# EasyEDA Pro project 电机驱动板.epro

# Schematic Schematic1
Create Date: 2023-03-19; Page Name: P1; Project Name: 电机驱动板; Schematic Name: Schematic1; Update Date: 2023-04-09; Company: 嘉立创EDA; Page Size: A4; Version: V1.0
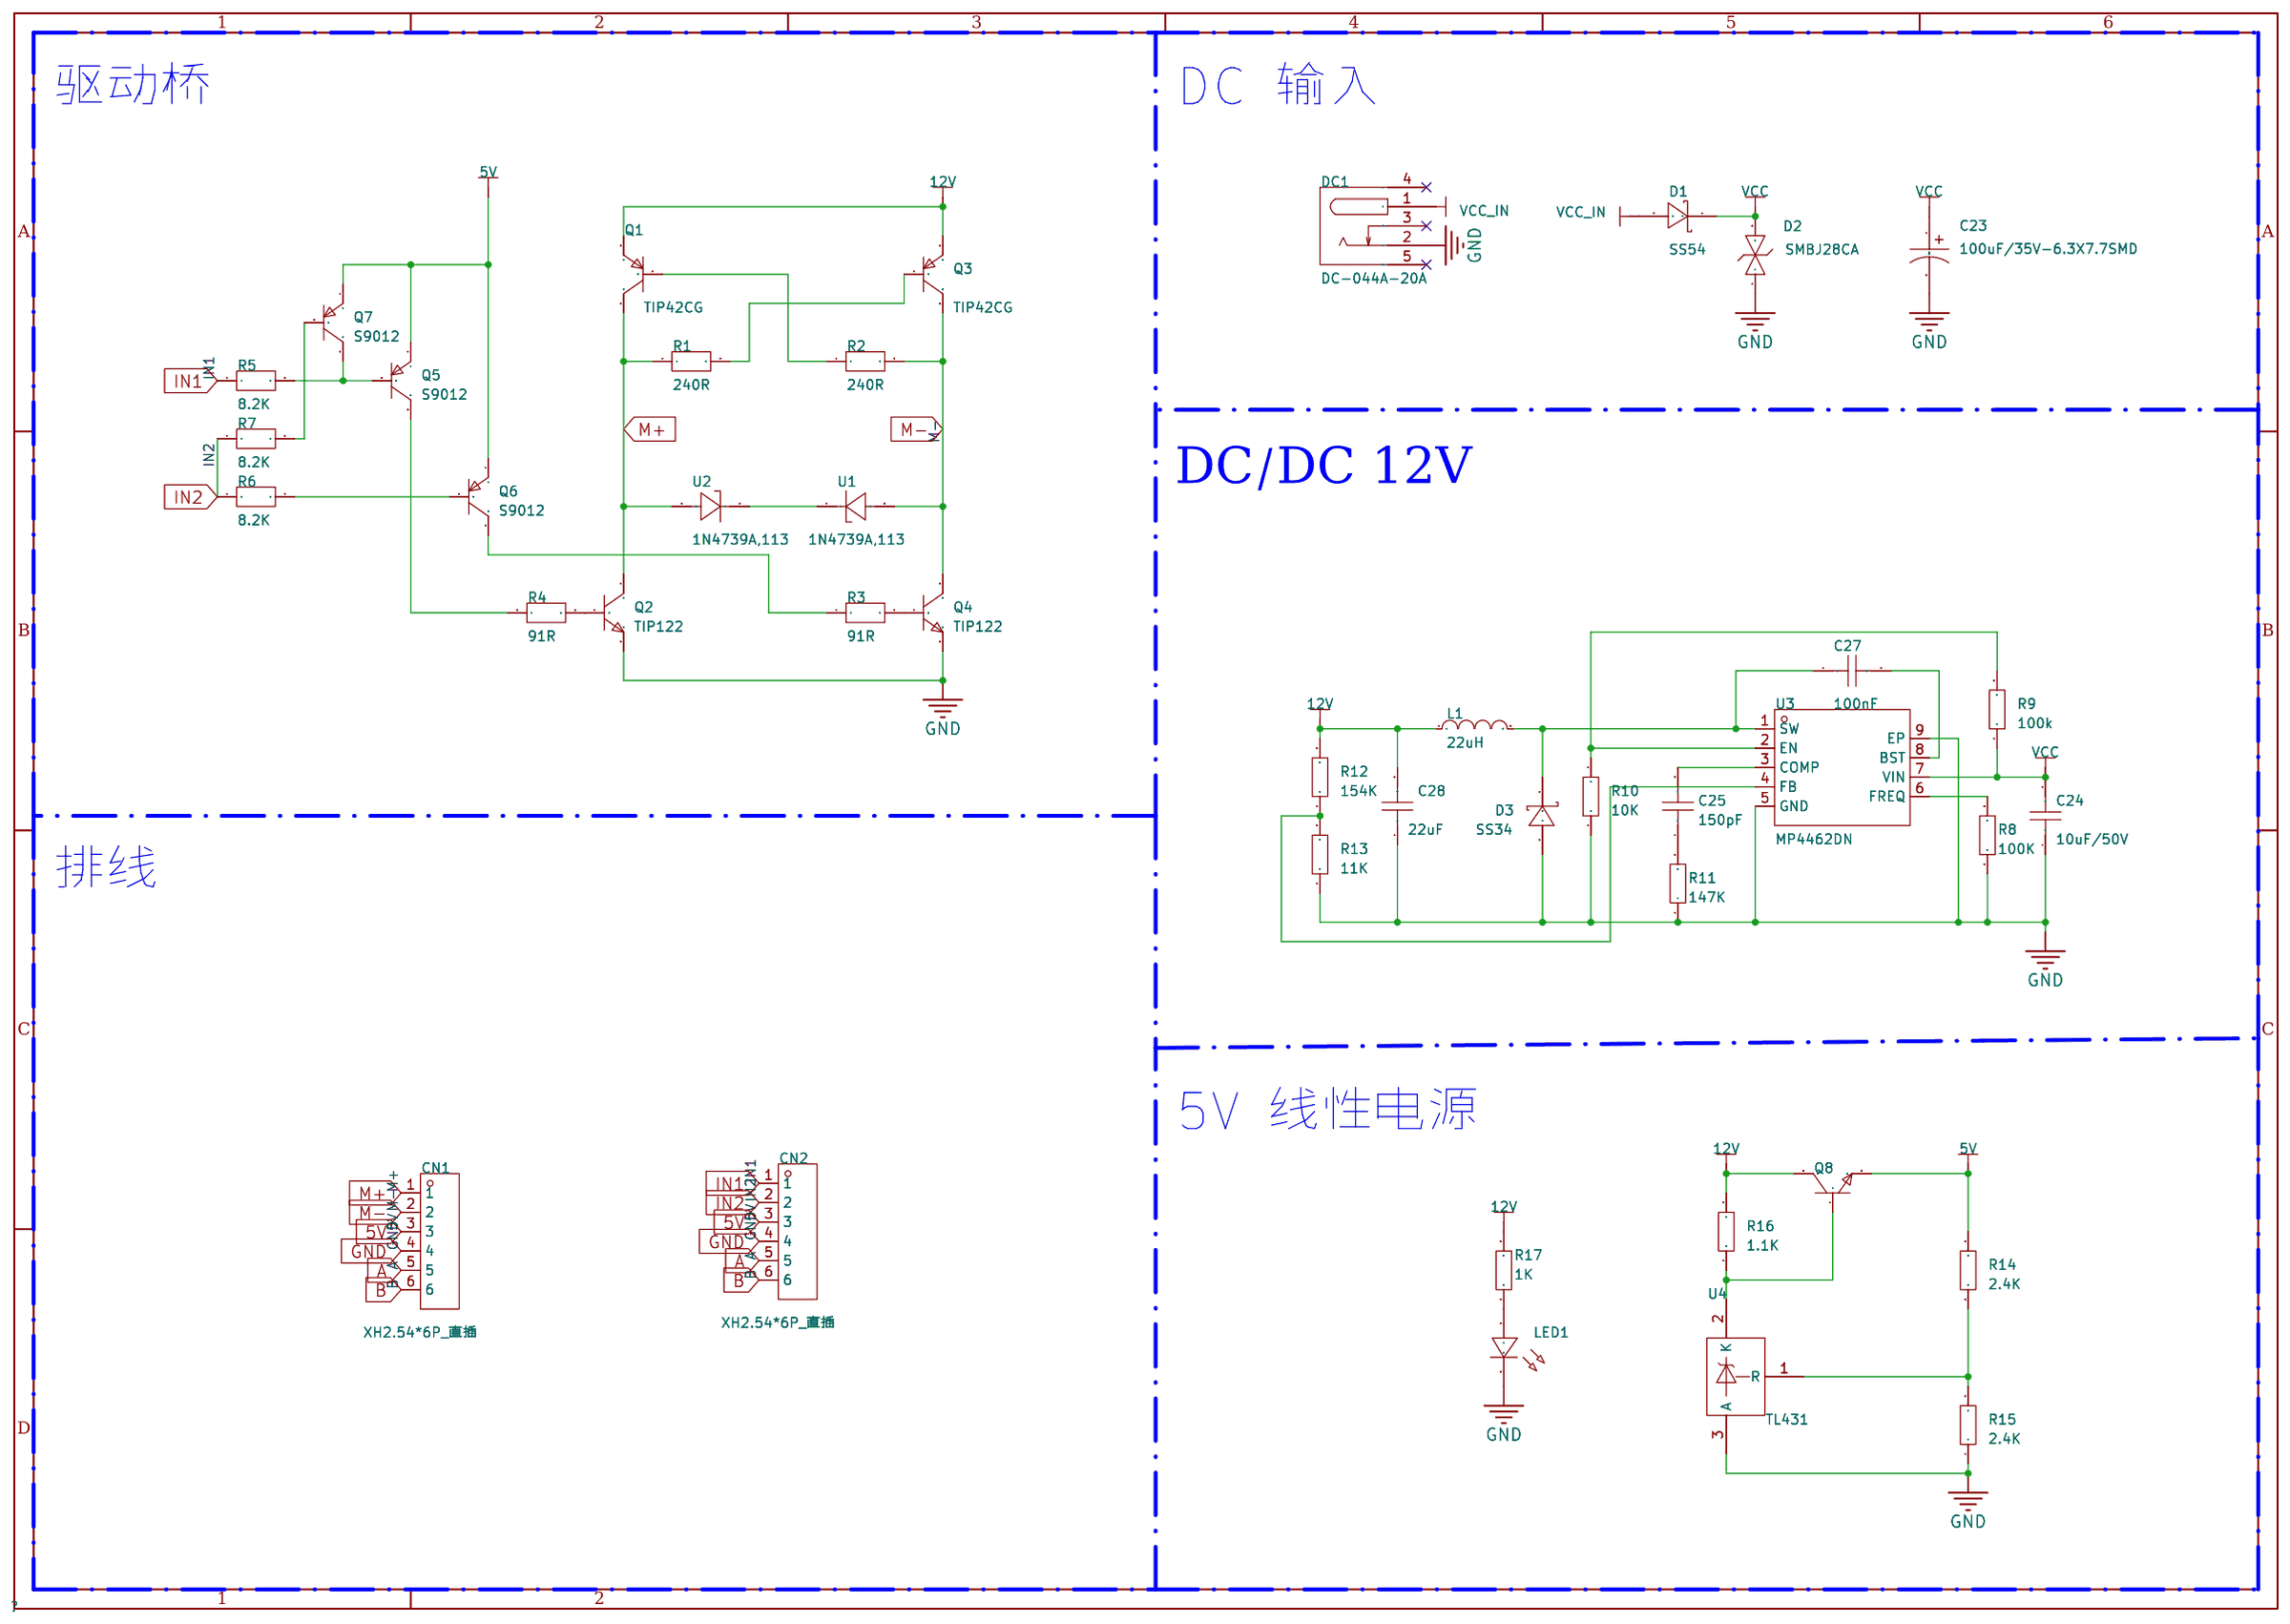
[diagram p0: schematic sheet]

## Parts
C23  100uF/35V-6.3X7.7SMD  [CAP-SMD_BD6.3-L6.6-W6.6-FD]
C24  10uF/50V  [C1206]
C25  150pF  [C0603]
C27  100nF  [C0603]
C28  22uF  [C0805]
CN1  XH2.54*6P_直插  [CONN-TH_XH2.54-6P]
CN2  XH2.54*6P_直插  [CONN-TH_XH2.54-6P]
D1  SS54  [SMA_L4.2-W2.6-LS5.3-RD]
D2  SMBJ28CA  [SMB_L4.6-W3.6-LS5.3-BI]
D3  SS34  [SMA_L4.3-W2.6-LS5.2-RD]
DC1  DC-044A-20A  [DC-IN-TH_DC-044A-20A]
L1  22uH  [IND-SMD_L11.0-W10.0]
LED1  -  [LED0805-RD_RED]
Q1  TIP42CG  [TO-220-3_L10.0-W4.5-P2.54-L]
Q2  TIP122  [TO-220-3_L10.0-W4.5-P2.54-L]
Q3  TIP42CG  [TO-220-3_L10.0-W4.5-P2.54-L]
Q4  TIP122  [TO-220-3_L10.0-W4.5-P2.54-L]
Q5  S9012  [TO-92-3_L5.1-W4.1-P1.27-L]
Q6  S9012  [TO-92-3_L5.1-W4.1-P1.27-L]
Q7  S9012  [TO-92-3_L5.1-W4.1-P1.27-L]
Q8  -  [S8050_SOT-23]
R1  240R  [RES-TH_BD2.4-L6.3-P10.30-D0.6]
R2  240R  [RES-TH_BD2.4-L6.3-P10.30-D0.6]
R3  91R  [RES-TH_BD2.4-L6.3-P10.30-D0.6]
R4  91R  [RES-TH_BD2.4-L6.3-P10.30-D0.6]
R5  8.2K  [RES-TH_BD2.4-L6.3-P10.30-D0.6]
R6  8.2K  [RES-TH_BD2.4-L6.3-P10.30-D0.6]
R7  8.2K  [RES-TH_BD2.4-L6.3-P10.30-D0.6]
R8  100K  [R0603]
R9  100k  [R0603]
R10  10K  [R0603]
R11  147K  [R0603]
R12  154K  [R0603]
R13  11K  [R0603]
R14  2.4K  [R0603]
R15  2.4K  [R0603]
R16  1.1K  [R0603]
R17  10K  [R0603]
U1  1N4739A,113  [DO-41_BD2.4-L4.7-P8.70-D0.8-RD]
U2  1N4739A,113  [DO-41_BD2.4-L4.7-P8.70-D0.8-RD]
U3  MP4462DN  [SOIC-8_L4.9-W3.9-P1.27-LS6.0-BL-EP3.4]
U4  TL431  [SOT-23-3_L2.9-W1.4-P1.90-LS2.6-BR]

## Library data of the parts
C23 = 100uF/35V-6.3X7.7SMD: Supplier Part: C9900004345; Supplier Footprint: 6.3X7.7SMD; JLCPCB Part Class: 扩展库; Datasheet: https://atta.szlcsc.comnull; Supplier: LCSC
C24 = CAP_1206: Supplier Footprint: 1206
C25 C27 = CAP_0603: Supplier Footprint: 0603
C28 = CAP_0805: Supplier Footprint: 0805
CN1 CN2 = XH2.54*6P_直插: Supplier Part: C9900008614; Supplier Footprint: XH2.54_6P; JLCPCB Part Class: Extended Part; Supplier: LCSC
D1 = SS54: Supplier Part: C2929944; Manufacturer: CJ(江苏长电/长晶); Supplier Footprint: SMAG; Datasheet: https://atta.szlcsc.com/upload/public/pdf/source/20220614/5F851C6501CD456476EE6414B9DEDB2D.pdf; Supplier: LCSC
D2 = SMBJ28CA_C726872: 极性:双向;; LCSC Part Name: 双向; Supplier Part: C726872; Manufacturer: TWGMC(台湾迪嘉); Supplier Footprint: SMB; JLCPCB Part Class: 扩展库; Datasheet: https://atta.szlcsc.com/upload/public/pdf/source/20200901/C726811_07201DC3516E92FF13903A0BAE18F725.pdf; Supplier: LCSC; Polarity: 双向
D3 = SS34_C8678: 二极管配置:独立式;直流反向耐压(Vr):40V;平均整流电流(Io):3A;正向压降(Vf):550mV@3A;反向电流(Ir):500uA@40V;; LCSC Part Name: 40V 3A 550mV@3A; Supplier Part: C8678; Manufacturer: MDD; Supplier Footprint: SMA(DO-214AC); JLCPCB Part Class: Basic Part; Datasheet: https://atta.szlcsc.com/upload/public/pdf/source/20230314/A80AE34493C69B89E2F4B1712F433538.pdf; Supplier: LCSC; Diode Configuration: 独立式; Reverse Voltage (Vr): 40V; Average Rectified Current (Io): 3A; Forward Voltage (Vf@If): 550mV@3A; Reverse Leakage Current (Ir): 500uA@40V
DC1 = DC-044A-20A: 触点内径:2mm;触点外径:0.9mm;; LCSC Part Name: DC座 内铁芯2.0 11.6mm*10.1mm; Supplier Part: C129006; Manufacturer: 韩国韩荣; Supplier Footprint: Through Hole; JLCPCB Part Class: Extended Part; Datasheet: https://atta.szlcsc.com/upload/public/pdf/source/20210810/C8974B0AB7FDF70EB0A74D74746E6460.pdf; Supplier: LCSC; Inside Contact Diameter: 2mm; Outside Contact Diameter: 0.9mm
L1 = TMPC1004H-220MG-D: 额定电流:5A;直流电阻(DCR):64mΩ;精度:±20%;电感值:22uH;; LCSC Part Name: 22uH ±20%; Supplier Part: C357235; Manufacturer: TAI-TECH(台庆); Supplier Footprint: SMD; JLCPCB Part Class: Extended Part; Datasheet: https://atta.szlcsc.com/upload/public/pdf/source/20200917/C357235_4F4DF2089AC33CD332F52F0FB37977C7.pdf; Supplier: LCSC; Rated Current: 5A; Width: 10mm; DC Resistance (DCR): 64mΩ; Tolerance: ±20%; Height: 3.8mm; Length: 11mm
LED1 = LED_0805-G: Supplier Footprint: 0805
Q1 Q3 = TIP42CG: 晶体管类型:PNP;集射极击穿电压(Vceo):100V;集电极电流(Ic):6A;功率(Pd):65W;集电极截止电流(Icbo):-;集电极-发射极饱和电压(VCE(sat)@Ic,Ib):1.5V@6A,600mA;直流电流增益(hFE@Ic,Vce):15@3A,4V;特征频率(fT):3MHz;工作温度:-65℃~+150℃@(Tj);; LCSC Part Name: PNP 双极功率晶体管; Supplier Part: C513077; Manufacturer: onsemi(安森美); Supplier Footprint: TO-220; JLCPCB Part Class: Extended Part; Datasheet: https://atta.szlcsc.com/upload/public/pdf/source/20180713/C233724_05A191E9B48E3320936F51A6FFDEC07B.pdf; Supplier: LCSC; Transistor Type: PNP; Collector-Emitter Breakdown Voltage (Vceo): 100V; Collector Current (Ic): 6A; Power Dissipation (Pd): 65W; Collector-Emitter Saturation Voltage (VCE(sat)@Ic,Ib): 1.5V@6A,600mA; DC Current Gain (hFE@Ic,Vce): 15@3A,4V; Transition Frequency (fT): 3MHz; Operating Temperature: -65℃~+150℃@(Tj)
Q2 Q4 = TIP122_C458982: 类型:NPN;集射极击穿电压(Vceo):100V;集电极电流(Ic):5A;功率(Pd):65W;集电极截止电流(Icbo@Vcb):200uA@100V;集电极-发射极饱和电压((VCE(sat)@Ic,Ib):4V@5A,20mA;直流电流增益(hFE@Vce,Ic):1000@3V,3A;特征频率(fT):-;工作温度:-65℃~+150℃@(Tj);; LCSC Part Name: NPN 100V 5A; Supplier Part: C458982; Manufacturer: Slkor(萨科微); Supplier Footprint: TO-220; JLCPCB Part Class: Extended Part; Datasheet: https://atta.szlcsc.com/upload/public/pdf/source/20191121/C458982_A2D3711224B7CAF7EB3EB944DBCD146E.pdf; Supplier: LCSC; Transistor Type: NPN; Collector-emitter voltage (Vceo): 100V; Collector Current (Ic): 5A; Power Dissipation (Pd): 65W; Collector cut-off current (Icbo@Vcb): 200uA@100V; Collector-emitter saturation voltage (VCE(sat)@Ic,Ib): 4V@5A,20mA; DC current gain (hFE@Vce,Ic): 1000@3V,3A; Operating Temperature: -65℃~+150℃@(Tj)
Q5-Q7 = S9012_C12053: 晶体管类型:PNP;集射极击穿电压(Vceo):25V;集电极电流(Ic):500mA;功率(Pd):625mW;集电极截止电流(Icbo):100nA;集电极-发射极饱和电压(VCE(sat)@Ic,Ib):600mV@500mA,50mA;直流电流增益(hFE@Ic,Vce):144@50mA,1V;特征频率(fT):150MHz;工作温度:+150℃@(Tj);; LCSC Part Name: PNP 25V 500mA H档  144~202; Supplier Part: C12053; Manufacturer: CJ(江苏长电/长晶); Supplier Footprint: TO-92(TO-92-3); JLCPCB Part Class: Extended Part; Datasheet: https://atta.szlcsc.com/upload/public/pdf/source/20140815/1457707217397.pdf; Supplier: LCSC; Transistor Type: PNP; Collector-Emitter Breakdown Voltage (Vceo): 25V; Collector Current (Ic): 500mA; Power Dissipation (Pd): 625mW; Collector Cut-Off Current (Icbo): 100nA; Collector-Emitter Saturation Voltage (VCE(sat)@Ic,Ib): 600mV@500mA,50mA; DC Current Gain (hFE@Ic,Vce): 144@50mA,1V; Transition Frequency (fT): 150MHz; Operating Temperature: +150℃@(Tj)
Q8 = S8050_SOT_NPN: Supplier Footprint: SOT-23
R1-R7 = RN1/4W2KFT/BA1: 电阻类型:金属膜电阻;阻值:2kΩ;精度:±1%;功率:250mW;温度系数:±50ppm/℃;最大工作电压:250V;工作温度范围:-55℃~+125℃;; LCSC Part Name: 金属膜电阻 2kΩ ±1% 250mW; Supplier Part: C410663; Manufacturer: Tyohm(幸亚电阻); Supplier Footprint: 插件; JLCPCB Part Class: Extended Part; Datasheet: https://atta.szlcsc.com/upload/public/pdf/source/20190808/C410663_68D03CFF9016EFC4A11955A78BE20EC9.pdf; Supplier: LCSC; Type: 金属膜电阻; Tolerance: ±1%; Power(Watts): 250mW; Temperature Coefficient: ±50ppm/℃; Overload Voltage (Max): 250V; Operating Temperature Range: -55℃~+125℃
R8-R17 = Res_0603: Supplier Footprint: 0603
U1 U2 = 1N4739A,113: Supplier Part: C503415; Manufacturer: Nexperia(安世); Supplier Footprint: DO-41; JLCPCB Part Class: Extended Part; Supplier: LCSC
U3 = MP4462DN: Supplier Part: C2917220; Supplier Footprint: SO-8EP; JLCPCB Part Class: Extended Part; Datasheet: 2021-11-08/1453210A/7ceaa83bf64544a9901b77a7a0ba484a/MP4462.pdf; Supplier: LCSC
U4 = TL431_C963380: 电压基准类型:并联;输出类型:可调;输入电压:37V;输出电压:2.5V~36V;输出电流:-;精度:-;温度系数:50ppm/℃;静态电流:-;最小阴极电流调节:1mA;噪声(0.1Hz-10Hz):-;噪声(10Hz-10kHz):-;动态阻抗:150mΩ;工作温度:-25℃~+85℃@(Topr);; LCSC Part Name: 并联 2.5V~36V; Supplier Part: C963380; Manufacturer: JSMSEMI(杰盛微); Supplier Footprint: SOT-23; JLCPCB Part Class: Extended Part; Datasheet: https://atta.szlcsc.com/upload/public/pdf/source/20211201/EE02BA953BE41909F74D12B934756247.pdf; Supplier: LCSC; Reference Type: 并联; Output Type: 可调; Input Voltage: 37V; Output Voltage: 2.5V~36V; Temperature Coefficient: 50ppm/℃; Minimum Cathode Current for Regulation: 1mA; Dynamic Impedance: 150mΩ; Operating Temperature: -25℃~+85℃@(Topr)

## Nets
5V: CN1.3 CN2.3 Q5.1(E) Q6.1(E) Q7.1(E) Q8.2 R14.2
12V: C28.2 L1.1 Q1.3(E) Q3.3(E) Q8.3 R12.2 R16.2 R17.2
GND: C23.2 C24.1 C28.1 CN1.4 CN2.4 D2.1 D3.2(A) DC1.2 LED1.1(C) Q2.3(E) Q4.3(E) R8.1 R10.1 R11.1 R13.1 R15.1 U3.5(GND) U3.9(EP) U4.3(A)
VCC: C23.1 C24.2 D1.1(C) D2.2 R9.1 U3.7(VIN)
VCC_IN: D1.2(A) DC1.1
A: CN1.5 CN2.5
B: CN1.6 CN2.6
IN1: CN2.1 R5.1
IN2: CN2.2 R6.1 R7.1
M+: CN1.1 Q1.2(C) Q2.2(C) R1.1 U2.2(A)
M-: CN1.2 Q3.2(C) Q4.2(C) R2.2 U1.2(A)
$1N573: Q3.1(B) R1.2
$1N579: Q1.1(B) R2.1
$1N634: Q4.1(B) R3.2
$1N670: Q2.1(B) R4.2
$1N703: U1.1(K) U2.1(K)
$1N899: Q5.3(C) R4.1
$1N1051: Q6.2(B) R6.2
$1N1187: Q7.2(B) R7.2
$1N1200: Q5.2(B) Q7.3(C) R5.2
$1N4344: R8.2 U3.6(FREQ)
$1N4470: R9.2 R10.2 U3.2(EN)
$1N4668: C25.2 U3.3(COMP)
$1N4692: C25.1 R11.2
$1N5863: R12.1 R13.2 U3.4(FB)
$1N5940: C27.2 U3.8(BST)
$1N5949: C27.1 D3.1(K) L1.2 U3.1(SW)
$1N6213: R14.1 R15.2 U4.1(R)
$1N6278: Q8.1 R16.1 U4.2(K)
$1N7382: LED1.2(A) R17.1
$1N8331: Q6.3(C) R3.1

Not connected (* = marked no-connect by the designer): DC1 3* 4* 5*

## Notes on the sheet
- 驱动桥
- DC 输入
- DC/DC 12V
- 排线
- 5V 线性电源

# Board PCB1
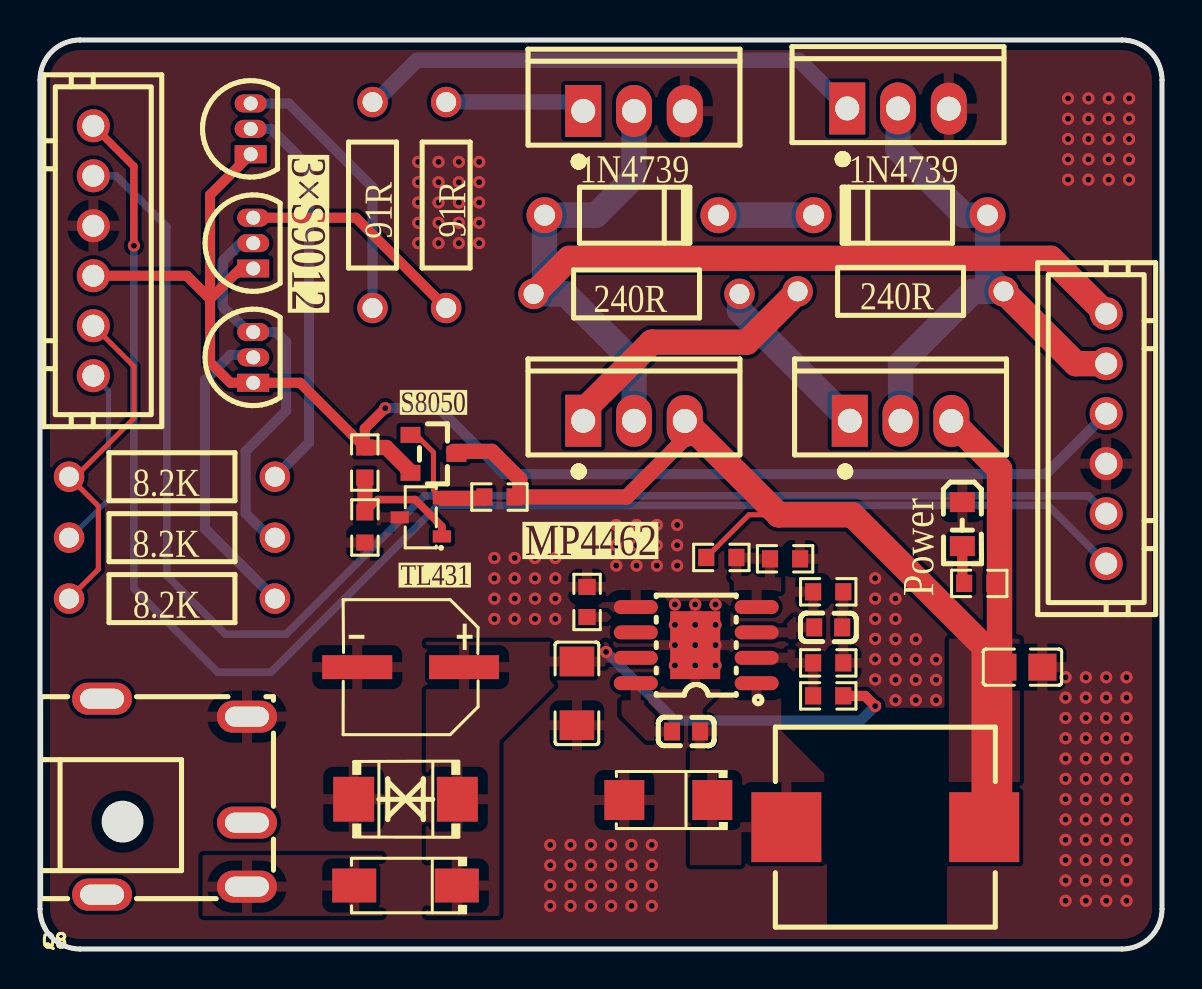
[diagram p1: board, top side]
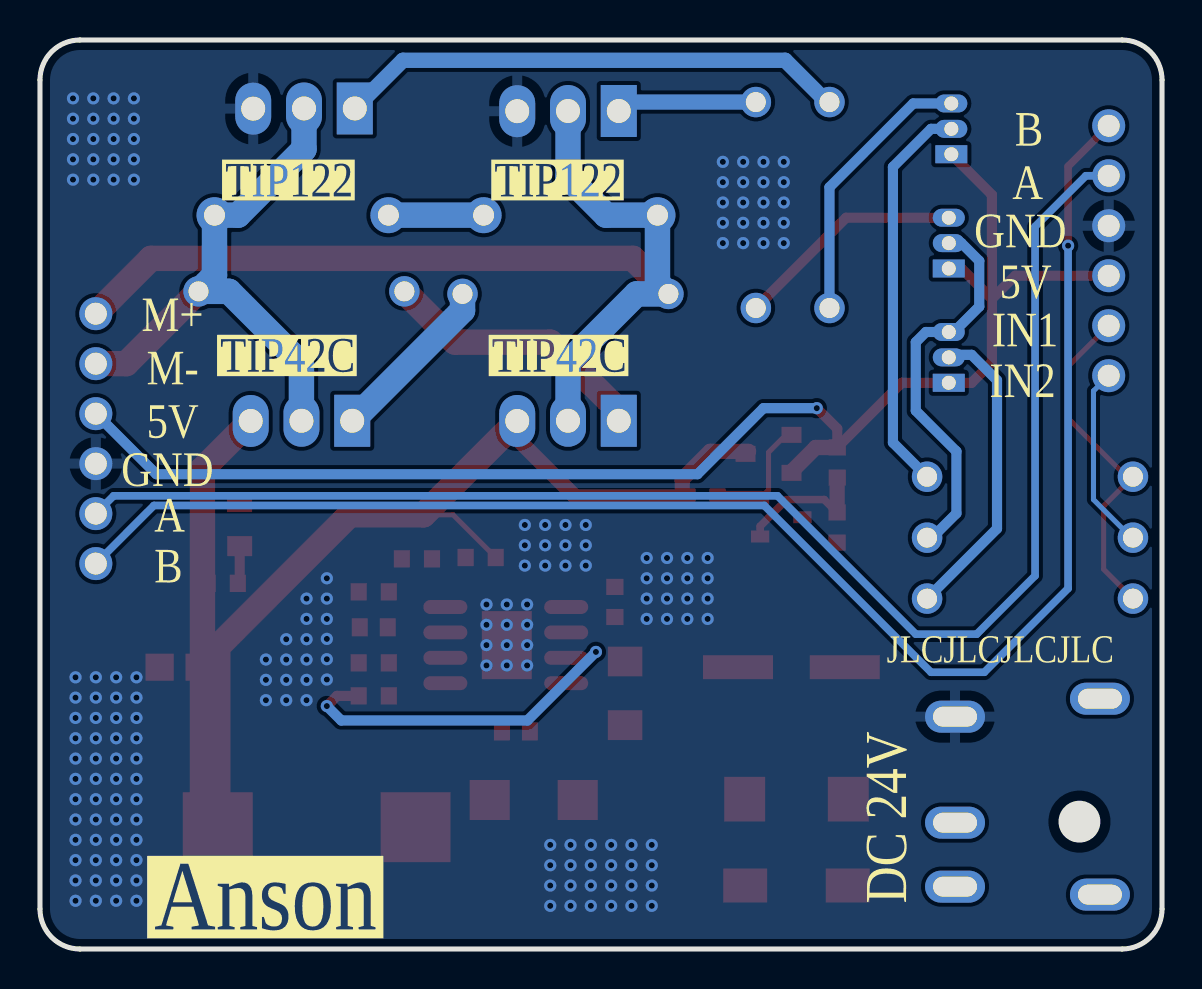
[diagram p2: board, bottom side, seen from below]

Outline 56.13 x 45.47 mm; copper layers: Top Layer, Bottom Layer. Coordinates in mm from the lower left corner of the outline.
Outline path: 0,43.47 0,2 arc(0.59,0.59) 2,0 54.13,0 arc(55.55,0.59) 56.13,2 56.13,43.47 arc(55.55,44.88) 54.13,45.47 2,45.47 arc(0.59,44.88) 0,43.47
Stack: Top Layer 0.035mm / Dielectric1 1.51mm FR4 er 4.5 / Bottom Layer 0.035mm

## Design rules (mm)
template: 自定义配置
spacing copperThickness1oz (default): track to track 0.102, other pairs 0.152 to 0.3
spacing copperThickness2oz: track to track 0.203, other pairs 0.152 to 0.3
track width copperThickness1oz (default): min 0.127, default 0.254, max 2.54
track width copperThickness2oz: min 0.203, default 0.254, max 2.54
differential pair differentialPair (default): width min 0.127, default 0.254, max 2.54; gap min 0.152, default 0.152
via viaSize (default): diameter min 0.5, default 0.61, max 10; hole min 0.3, default 0.305, max 6.3
net 12V uses copperRegion1
net GND uses copperRegion1
net VCC uses copperRegion1
net VCC_IN uses copperRegion1
net $1N5949 uses copperRegion1
net $1N4470 uses copperRegion1
net $1N4668 uses copperRegion1
net $1N5863 uses copperRegion1
net $1N5940 uses copperRegion1
net $1N4344 uses copperRegion1
net $1N4692 uses copperRegion1

## Placement (name value [footprint] x y rotation side)
C23  100uF/35V-6.3X7.7SMD  [CAP-SMD_BD6.3-L6.6-W6.6-FD]  18.54 14.1 180 top
C24  10uF/50V  [C1206]  26.86 12.79 90 top
C25  150pF  [C0603]  39.44 16.09 180 top
C27  100nF  [C0603]  32.32 10.88 180 top
C28  22uF  [C0805]  49.15 14.1 180 top
CN1  XH2.54*6P_直插  [CONN-TH_XH2.54-6P]  53.34 25.53 270 top
CN2  XH2.54*6P_直插  [CONN-TH_XH2.54-6P]  2.67 34.92 90 top
D1  SS54  [SMA_L4.2-W2.6-LS5.3-RD]  18.29 3.17 180 top
D2  SMBJ28CA  [SMB_L4.6-W3.6-LS5.3-BI]  18.29 7.49 0 top
D3  SS34  [SMA_L4.3-W2.6-LS5.2-RD]  31.43 7.45 180 top
DC1  DC-044A-20A  [DC-IN-TH_DC-044A-20A]  6.73 7.62 0 top
L1  22uH  [IND-SMD_L11.0-W10.0]  42.29 6.1 180 top
LED1  -  [LED0805-RD_RED]  46.14 21.25 270 top
Q1  TIP42CG  [TO-220-3_L10.0-W4.5-P2.54-L]  29.72 26.42 0 top
Q2  TIP122  [TO-220-3_L10.0-W4.5-P2.54-L]  29.72 41.91 0 top
Q3  TIP42CG  [TO-220-3_L10.0-W4.5-P2.54-L]  43.05 26.42 0 top
Q4  TIP122  [TO-220-3_L10.0-W4.5-P2.54-L]  42.93 42.04 0 top
Q5  S9012  [TO-92-3_L5.1-W4.1-P1.27-L]  10.67 35.31 90 top
Q6  S9012  [TO-92-3_L5.1-W4.1-P1.27-L]  10.54 41.02 90 top
Q7  S9012  [TO-92-3_L5.1-W4.1-P1.27-L]  10.67 29.59 90 top
Q8  -  [S8050_SOT-23]  19.69 24.89 180 top
R1  240R  [RES-TH_BD2.4-L6.3-P10.30-D0.6]  29.84 32.77 0 top
R2  240R  [RES-TH_BD2.4-L6.3-P10.30-D0.6]  43.05 32.89 0 top
R3  91R  [RES-TH_BD2.4-L6.3-P10.30-D0.6]  16.64 37.21 90 top
R4  91R  [RES-TH_BD2.4-L6.3-P10.30-D0.6]  20.32 37.21 90 top
R5  8.2K  [RES-TH_BD2.4-L6.3-P10.30-D0.6]  6.6 20.57 0 top
R6  8.2K  [RES-TH_BD2.4-L6.3-P10.30-D0.6]  6.6 23.62 0 top
R7  8.2K  [RES-TH_BD2.4-L6.3-P10.30-D0.6]  6.6 17.53 0 top
R8  100K  [R0603]  27.37 17.36 270 top
R9  100k  [R0603]  39.44 12.66 180 top
R10  10K  [R0603]  39.44 14.31 180 top
R11  147K  [R0603]  39.44 17.87 0 top
R12  154K  [R0603]  34.09 19.58 180 top
R13  11K  [R0603]  37.28 19.52 180 top
R14  2.4K  [R0603]  16.25 24.33 90 top
R15  2.4K  [R0603]  16.26 21.08 90 top
R16  1.1K  [R0603]  22.99 22.61 0 top
R17  10K  [R0603]  46.99 18.29 0 top
U1  1N4739A,113  [DO-41_BD2.4-L4.7-P8.70-D0.8-RD]  43.05 36.7 0 top
U2  1N4739A,113  [DO-41_BD2.4-L4.7-P8.70-D0.8-RD]  29.59 36.7 180 top
U3  MP4462DN  [SOIC-8_L4.9-W3.9-P1.27-LS6.0-BL-EP3.4]  32.83 15.2 90 top
U4  TL431  [SOT-23-3_L2.9-W1.4-P1.90-LS2.6-BR]  19.05 21.59 0 top

## Footprints (pads in the part's own frame, mm; a bottom-side part is the same pattern mirrored in y, then rotated)
C0603
  rect 0.8x0.9 smd: 1(-0.7,0) 2(0.7,0)
C0805
  rect 1.41x1.35 smd: 1(-1,0) 2(1,0)
C1206
  rect 1.485x1.728 smd: 1(-1.593,0) 2(1.593,0)
CAP-SMD_BD6.3-L6.6-W6.6-FD
  rect 3.5x1.2 smd: 1(-2.67,0) 2(2.67,0)
CONN-TH_XH2.54-6P
  round 1.65 hole 1.1: 1(-6.25,0) 2(-3.75,0) 3(-1.25,0) 4(1.25,0) 5(3.75,0) 6(6.25,0)
DC-IN-TH_DC-044A-20A
  oval 3x1.6 hole 2.2x1: 1(3.625,-4.5) 2(3.625,4.001) 3(3.625,-1.3) 4(-3.625,-4.9) 5(-3.625,4.9)
DO-41_BD2.4-L4.7-P8.70-D0.8-RD
  round 1.8 hole 1.05: 1(-4.35,0) 2(4.35,0)
IND-SMD_L11.0-W10.0
  rect 3.5x3.5 smd: 1(-4.95,0) 2(4.95,0)
LED0805-RD_RED
  rect 1x1.25 smd: 1(-1.1,0) 2(1.1,0)
R0603
  rect 0.806x0.864 smd: 1(-0.753,0) 2(0.753,0)
RES-TH_BD2.4-L6.3-P10.30-D0.6
  round 1.524 hole 1: 1(-5.15,0) 2(5.15,0)
S8050_SOT-23
  rect 1x0.8 smd: 1(1.15,-0.823) 2(1.15,1.077) 3(-1.15,0.127)
SMA_L4.2-W2.6-LS5.3-RD
  rect 2.2x1.7 smd: 1(-2.566,0) 2(2.566,0)
SMA_L4.3-W2.6-LS5.2-RD
  rect 2x2 smd: 1(-2.2,0) 2(2.2,0)
SMB_L4.6-W3.6-LS5.3-BI
  rect 2.047x2.241 smd: 1(-2.591,0) 2(2.591,0)
SOIC-8_L4.9-W3.9-P1.27-LS6.0-BL-EP3.4
  oval 0.7x2.2 smd: 1(-1.905,-3.022) 2(-0.635,-3.022) 3(0.635,-3.022) 4(1.905,-3.022) 5(1.905,3.022) 6(0.635,3.022) 7(-0.635,3.022) 8(-1.905,3.022)
  rect 3.4x2.5 smd: 9(0,0.051)
SOT-23-3_L2.9-W1.4-P1.90-LS2.6-BR
  rect 0.91x0.6 smd: 1(1.055,-0.955) 2(1.055,0.955) 3(-1.055,0)
TO-92-3_L5.1-W4.1-P1.27-L
  rect 0.9x1.6 hole 0.7: 1(-1.27,0)
  oval 0.9x1.6 hole 0.7: 2(0,0) 3(1.27,0)
TO-220-3_L10.0-W4.5-P2.54-L
  rect 1.8x2.6 hole 1.2: 1(-2.54,0.005)
  oval 1.8x2.6 hole 1.2: 2(0,0.005) 3(2.54,-0.005)

## Nets
As in the schematic.

Pads without a net: DC1 3 4 5

## Via types
v1: diameter 0.61, hole 0.305, Top Layer to Bottom Layer, 175 vias

## Routing (per net, layer and track width the routed paths; a pad name or vN(x,y) marks a point on that pad's centre or on a via; arc(x,y) is an arc through that point)
5V: length 73.6
  Top Layer w0.508: v1(17.27,27.05) 16.25,26.03 R14.2 13.01,28.32 Q7.1 9.53,28.32 8.51,29.34 8.51,32.51 ; CN2.3 7.35,33.67 8.51,32.51 ; 8.51,32.51 8.51,37.72 Q6.1 ; 8.51,32.51 10.03,34.04 Q5.1
  Top Layer w0.762: 18.47,23.94 17.33,25.08 R14.2
  Bottom Layer w0.508: CN1.3 50.31,23.75 23.24,23.75 19.94,27.05 v1(17.27,27.05)
12V: length 70.3
  Top Layer w0.254: 36.95,21.72 35.47,21.72 R12.2
  Top Layer w0.762: Q1.3 32.26,25.52 29.34,22.61 R16.2 24,22.87 24,23.5 22.61,24.89 20.69,24.89
  Top Layer w1.27: Q3.3 48.01,24 48.01,6.86 L1.1 47.24,15.12 40.64,21.72 36.95,21.72 Q1.3
GND:
  vias: v1(18.92,39.37) v1(18.92,38.35) v1(18.92,37.34) v1(18.92,36.32) v1(18.92,35.31) v1(19.94,39.37) v1(19.94,38.35) v1(19.94,37.34) v1(19.94,36.32) v1(19.94,35.31) v1(20.96,39.37) v1(20.96,38.35) v1(20.96,37.34) v1(20.96,36.32) v1(20.96,35.31) v1(21.97,39.37) v1(21.97,38.35) v1(21.97,37.34) v1(21.97,36.32) v1(21.97,35.31) v1(22.73,19.56) v1(22.73,18.54) v1(22.73,17.53) v1(22.73,16.51) v1(23.75,19.56) v1(23.75,18.54) v1(23.75,17.53) v1(23.75,16.51) v1(24.76,19.56) v1(24.76,18.54) v1(24.76,17.53) v1(24.76,16.51) v1(25.53,5.21) v1(25.53,4.19) v1(25.53,3.17) v1(25.53,2.16) v1(25.78,19.56) v1(25.78,18.54) v1(25.78,17.53) v1(25.78,16.51) v1(26.54,5.21) v1(26.54,4.19) v1(26.54,3.17) v1(26.54,2.16) v1(27.56,5.21) v1(27.56,4.19) v1(27.56,3.17) v1(27.56,2.16) v1(28.57,5.21) v1(28.57,4.19) v1(28.57,3.17) v1(28.57,2.16) v1(28.83,21.21) v1(28.83,20.19) v1(28.83,19.18) v1(29.59,5.21) v1(29.59,4.19) v1(29.59,3.17) v1(29.59,2.16) v1(29.84,21.21) v1(29.84,20.19) v1(29.84,19.18) v1(30.61,5.21) v1(30.61,4.19) v1(30.61,3.17) v1(30.61,2.16) v1(30.86,21.21) v1(30.86,20.19) v1(30.86,19.18) v1(31.76,17.23) v1(31.76,16.22) v1(31.76,15.2) v1(31.76,14.18) v1(31.88,21.21) v1(31.88,20.19) v1(31.88,19.18) v1(32.78,17.23) v1(32.78,16.22) v1(32.78,15.2) v1(32.78,14.18) v1(33.8,17.23) v1(33.8,16.22) v1(33.8,15.2) v1(33.8,14.18) v1(41.78,18.54) v1(41.78,17.53) v1(41.78,16.51) v1(41.78,15.51) v1(41.78,14.49) v1(41.78,13.48) v1(42.8,17.53) v1(42.8,16.51) v1(42.8,15.49) v1(42.8,14.48) v1(42.8,13.46) v1(42.8,12.45) v1(43.81,15.49) v1(43.81,14.48) v1(43.81,13.46) v1(43.81,12.45) v1(44.83,14.48) v1(44.83,13.46) v1(44.83,12.45) v1(51.31,13.59) v1(51.31,12.57) v1(51.31,11.56) v1(51.31,10.54) v1(51.31,9.53) v1(51.31,8.51) v1(51.31,7.49) v1(51.31,6.48) v1(51.31,5.46) v1(51.31,4.44) v1(51.31,3.43) v1(51.31,2.41) v1(51.44,42.55) v1(51.44,41.53) v1(51.44,40.51) v1(51.44,39.5) v1(51.44,38.48) v1(52.32,13.59) v1(52.32,12.57) v1(52.32,11.56) v1(52.32,10.54) v1(52.32,9.53) v1(52.32,8.51) v1(52.32,7.49) v1(52.32,6.48) v1(52.32,5.46) v1(52.32,4.44) v1(52.32,3.43) v1(52.32,2.41) v1(52.45,42.55) v1(52.45,41.53) v1(52.45,40.51) v1(52.45,39.5) v1(52.45,38.48) v1(53.34,13.59) v1(53.34,12.57) v1(53.34,11.56) v1(53.34,10.54) v1(53.34,9.53) v1(53.34,8.51) v1(53.34,7.49) v1(53.34,6.48) v1(53.34,5.46) v1(53.34,4.44) v1(53.34,3.43) v1(53.34,2.41) v1(53.47,42.55) v1(53.47,41.53) v1(53.47,40.51) v1(53.47,39.5) v1(53.47,38.48) v1(54.36,13.59) v1(54.36,12.57) v1(54.36,11.56) v1(54.36,10.54) v1(54.36,9.53) v1(54.36,8.51) v1(54.36,7.49) v1(54.36,6.48) v1(54.36,5.46) v1(54.36,4.44) v1(54.36,3.43) v1(54.36,2.41) v1(54.48,42.55) v1(54.48,41.53) v1(54.48,40.51) v1(54.48,39.5) v1(54.48,38.48)
VCC: length 17
  Top Layer w0.508: R9.1 41.28,12.66 v1(41.78,12.15)
  Bottom Layer w0.508: v1(28.32,14.86) 31.75,11.43 41.06,11.43 v1(41.78,12.15)
A: length 73.6
  Bottom Layer w0.381: CN1.5 52.45,22.67 19.24,22.67 12.32,15.75 9.27,15.75 6.35,18.67 6.35,36.14 3.81,38.67 CN2.5
B: length 79
  Top Layer w0.381: CN2.6 4.7,39.14 v1(4.7,35.18)
  Bottom Layer w0.381: CN1.6 50.43,22.18 19.9,22.18 11.56,13.84 8.89,13.84 4.7,18.03 v1(4.7,35.18)
IN1: length 9.3
  Bottom Layer w0.254: CN2.1 3.43,27.91 3.43,22.48 1.52,20.57 R5.1
IN2: length 17.2
  Top Layer w0.254: CN2.2 4.7,29.14 4.7,26.54 1.78,23.62 R6.1 2.92,22.16 2.92,18.99 R7.1
M+: length 52.6
  Top Layer w1.27: CN1.1 50.57,34.54 26.47,34.54 R1.1
  Bottom Layer w1.27: 29.72,41.92 29.72,38.61 27.81,36.7 U2.2 25.24,33.31 R1.1 26.29,32.77 29.72,29.34 Q1.2
M-: length 28.2
  Top Layer w1.27: R2.2 51.82,29.28 CN1.2
  Bottom Layer w1.27: Q4.2 42.93,40 46.23,36.7 U1.2 47.4,33.69 R2.2 46.68,32.89 43.05,29.27 Q3.2
$1N573: length 8.6
  Bottom Layer w1.27: R1.2 35,31.94 Q3.1
$1N579: length 13.7
  Top Layer w1.27: R2.1 35.36,30.35 30.61,30.35 27.18,26.92 Q1.1
$1N634: length 25.6
  Bottom Layer w0.762: R3.2 16.76,42.36 18.85,44.45 37.98,44.45 Q4.1
$1N670: length 7
  Bottom Layer w0.762: 27.18,41.92 26.73,42.36 R4.2
$1N703: length 4.8
  Bottom Layer w1.27: U2.1 U1.1
$1N899: length 11.5
  Top Layer w0.508: R4.1 15.81,36.58 Q5.3
$1N1051: length 19.9
  Bottom Layer w0.508: Q6.2 11.56,41.02 13.46,39.12 13.46,25.33 R6.2
$1N1187: length 15.4
  Bottom Layer w0.508: R7.2 8.25,21.03 8.25,28.45 9.53,29.72 10.54,29.72 Q7.2
$1N1200: length 19.5
  Bottom Layer w0.508: Q5.2 10.03,35.31 9.14,34.42 9.14,32.13 10.41,30.86 Q7.3 11.81,30.86 12.32,30.35 12.32,26.92 10.29,24.89 10.29,21.79 11.5,20.57 R5.2
$1N6213: length 6.9
  Top Layer w0.381: R15.2 16.9,22.48 18.77,22.48 20.1,21.14 20.1,20.64
  Top Layer w0.762: R14.1 16.26,23.57 R15.2
$1N6278: length 6
  Top Layer w0.254: 18.69,25.84 19.69,24.84 19.69,22.97 20.1,22.55
  Top Layer w0.762: R16.1 22.17,22.55 20.1,22.55
$1N7382: length 1.9
  Top Layer w0.508: R17.1 46.14,18.38 LED1.2
$1N8331: length 13.9
  Bottom Layer w0.508: Q6.3 12.45,42.29 16.64,38.1 R3.1

## Copper pours and planes (outline as drawn; the poured copper is in the pictures)
12V on Top Layer: 45.47,15.52 49.02,15.52 49.02,4.32 45.47,4.32
GND on Top Layer: 0,45.47 56.13,45.47 56.13,0 0,0
GND on Bottom Layer: -0.25,45.72 56.13,45.72 56.13,0 -0.25,0
VCC on Top Layer: 30.99,14.1 30.99,14.98 28.73,14.98 28.35,15.37 19.3,15.37 19.3,1.65 22.99,1.65 22.99,10.41 26.16,13.59 28.19,13.59 28.7,14.1
VCC_IN on Top Layer: 8.13,4.7 17.15,4.7 17.15,1.65 8.13,1.65
$1N4344 on Top Layer: 30.99,15.37 28.96,15.37 28.32,16 26.87,16 26.87,17.02 28.19,17.02 28.96,16.26 30.99,16.26
$1N4470 on Top Layer: 39.12,14.98 39.12,12.12 38.05,12.12 38.05,13.51 37.34,14.22 34.67,14.22 34.67,14.98
$1N4668 on Top Layer: 34.67,16.26 37.34,16.26 37.72,16.64 39.24,16.64 39.24,15.49 34.67,15.49
$1N4692 on Top Layer: 39.75,18.29 40.64,18.29 40.64,15.62 39.75,15.62
$1N5863 on Top Layer: 34.42,20.07 34.42,18.67 34.7,18.38 34.7,16.59 37.08,16.59 37.08,20.07
$1N5940 on Top Layer: 32,11.43 31.02,11.43 30.23,12.23 30.23,13.59 29.08,13.59 29.08,11.68 30.35,10.41 32,10.41
$1N5949 on Top Layer: 34.65,13.21 33.25,11.81 32.51,11.81 32.51,4.19 39.24,4.19 39.24,8.76 37.08,10.92 37.08,13.84 34.65,13.84

## Text on the board
Bottom Silkscreen Layer: JLCJLCJLCJLC | B | A | 5V | IN1 | IN2 | GND | TIP122 | TIP42C | M- | M+ | DC 24V | Anson
Top Silkscreen Layer: S8050 | TL431 | 8.2K | 1N4739 | 240R | 91R | MP4462 | Power | 3×S9012
